# EAGLE design Motor shield 2.0 (EAGLE 6.3)
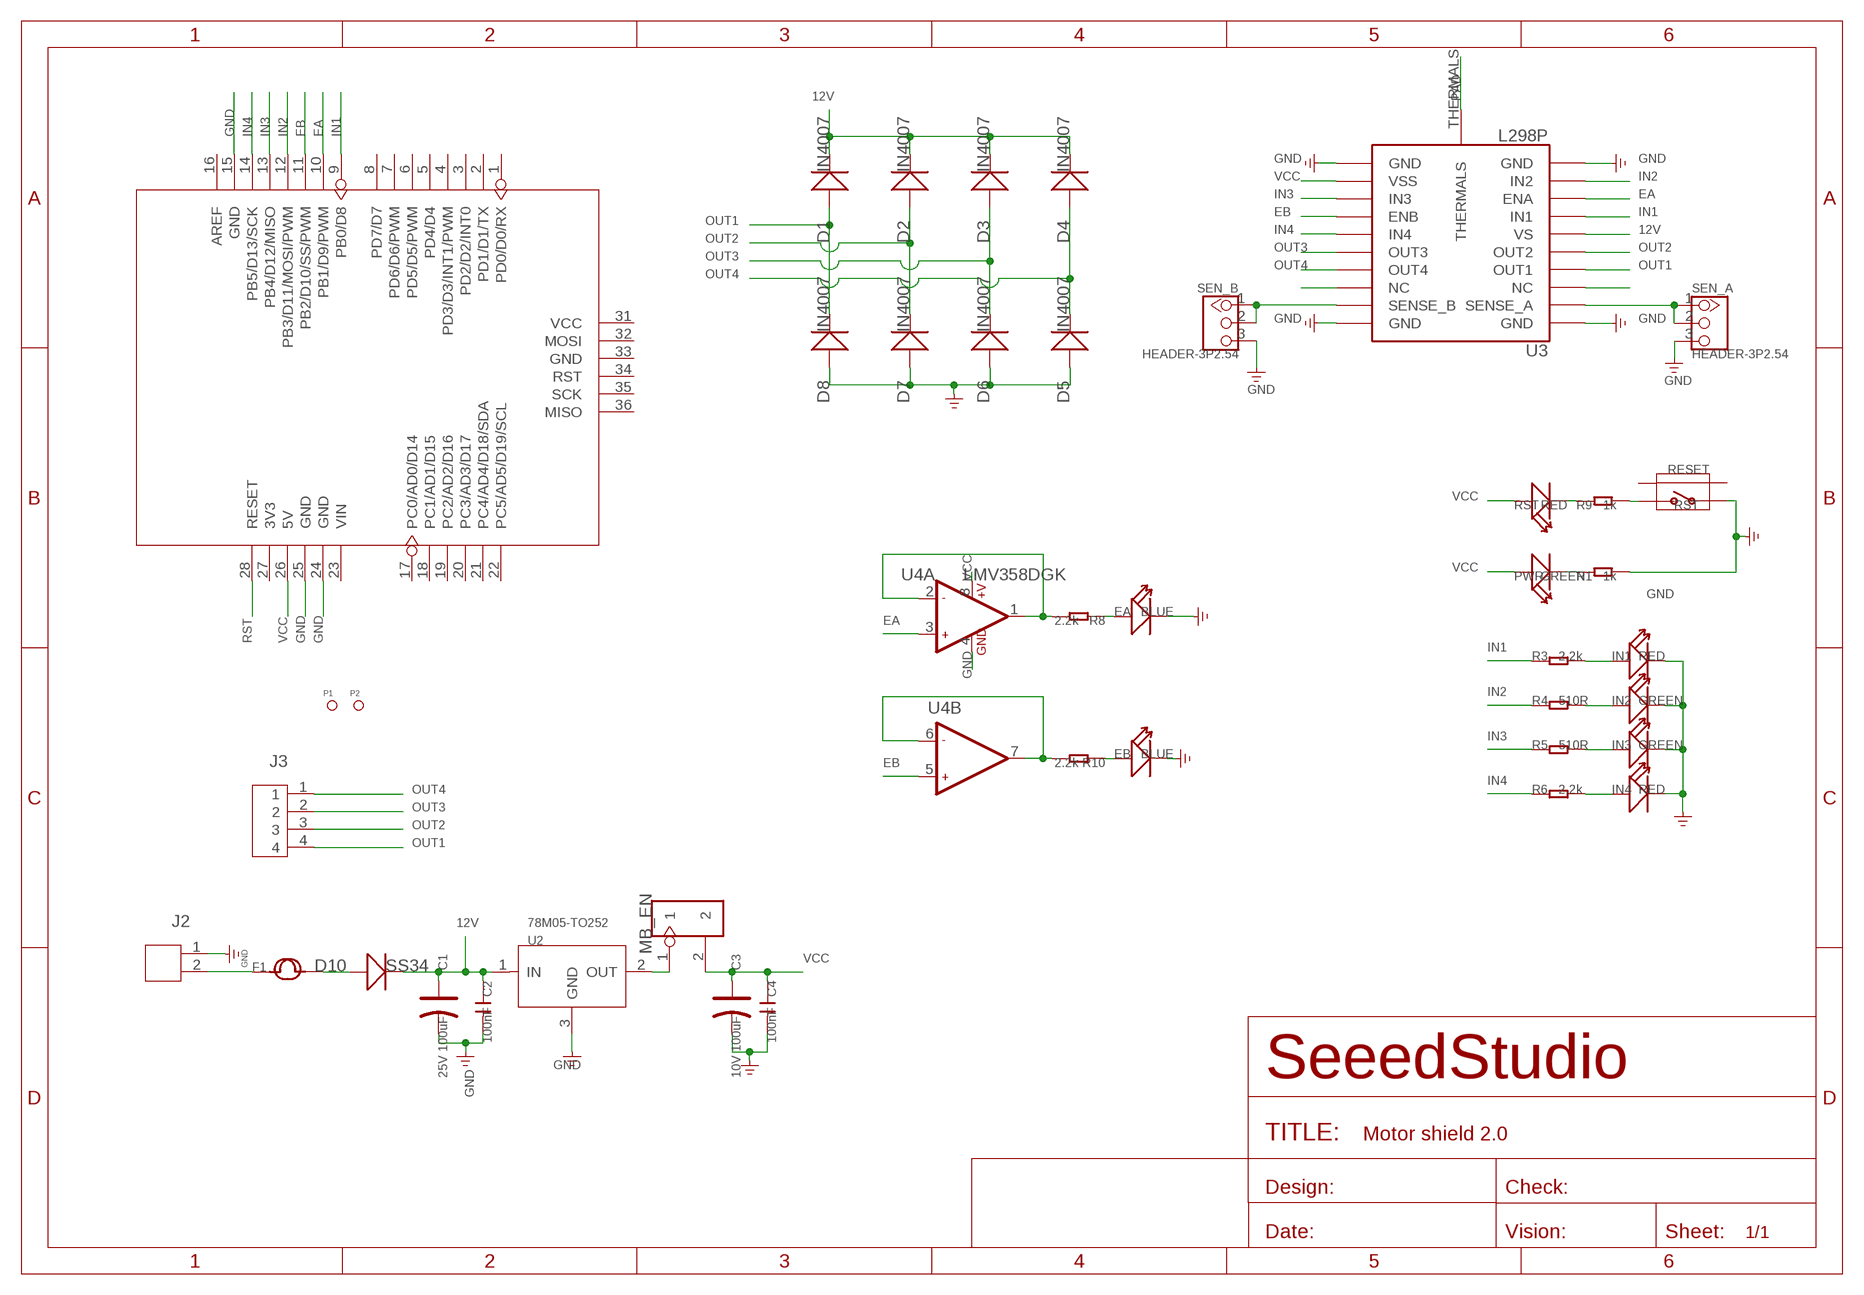
[diagram p0: schematic, sheet 1]

## Parts
C1  25V 100uF  CAP-ELECTRO-D  [ELECTRO-SMD-D-5.6MM]
C2  100nF  C-0603  [C0603]
C3  10V 100uF  CAP-AVX-B  [AVX-B]
C4  100nF  C-0603  [C0603]
D1  IN4007  D'SMA'  [D2010]
D2  IN4007  D'SMA'  [D2010]
D3  IN4007  D'SMA'  [D2010]
D4  IN4007  D'SMA'  [D2010]
D5  IN4007  D'SMA'  [D2010]
D6  IN4007  D'SMA'  [D2010]
D7  IN4007  D'SMA'  [D2010]
D8  IN4007  D'SMA'  [D2010]
D10  SS34  D'DO-214AB'  [DO-214AB]
EA  BLUE  007-LED0603  [D0603]
EB  BLUE  007-LED0603  [D0603]
F1  FUSE'RLD30P250UF'  [0311]
IN1  RED  007-LED0603  [D0603]
IN2  GREEN  007-LED0603  [D0603]
IN3  GREEN  007-LED0603  [D0603]
IN4  RED  007-LED0603  [D0603]
J2  JST-2P-LEADED'3.36'  [2P-3.36-LEADED-7X7]
J3  JST-4P-3.36-LEADED  [4P-3.36-LEADED-7X14]
MB_EN  HEADER-2P-65/35MIL  [2P-2.54-65/35MIL]
P1  PAD-MARK  [ROUND-MARK-1.0]
P2  PAD-MARK  [ROUND-MARK-1.0]
PWR  GREEN  007-LED0603  [D0603]
R1  1k  R-0603  [R0603]
R3  2.2k  R-0603  [R0603]
R4  510R  R-0603  [R0603]
R5  510R  R-0603  [R0603]
R6  2.2k  R-0603  [R0603]
R8  2.2k  R-0603  [R0603]
R9  1k  R-0603  [R0603]
R10  2.2k  R-0603  [R0603]
RESET  BUTTON-4P-REINFORCE'TS-118E'  [4P-SMD-7X3.5X3.5H]
RST  RED  007-LED0603  [D0603]
SEN_A  HEADER-3P2.54  [2.54_1X3P]
SEN_B  HEADER-3P2.54  [2.54_1X3P]
U1  ARDUINO'W/-SILK  [ARDUINO]
U2  78M05-TO252  [TO252]
U3  L298P  [POWERSO-20]
U4  LMV358DGK  [MSOP8]

## Nets
12V: C1.+ C2.1 D1.- D2.- D3.- D4.- D10.2(-) U2.1(IN) U3.P$6(VS)
EA: U1.10(PB1/D9/PWM) U3.P$8(ENA) U4.3(A:+IN1)
EB: U1.11(PB2/D10/SS/PWM) U3.P$14(ENB) U4.5(B:+IN2)
GND: C1.- C2.2 C3.- C4.2 D5.+ D6.+ D7.+ D8.+ EA.- EB.- IN1.- IN2.- IN3.- IN4.- J2.1 R1.2 RESET.1 SEN_A.3 SEN_B.3 U1.15(GND) U1.24(GND) U1.25(GND) U2.3(GND) U3.P$1(GND) U3.P$10(GND) U3.P$11(GND) U3.P$20(GND) U4.4(A:GND)
IN1: R3.1 U1.9(PB0/D8) U3.P$7(IN1)
IN2: R4.1 U1.12(PB3/D11/MOSI/PWM) U3.P$9(IN2)
IN3: R5.1 U1.13(PB4/D12/MISO) U3.P$13(IN3)
IN4: R6.1 U1.14(PB5/D13/SCK) U3.P$15(IN4)
N$1: IN3.+ R5.2
N$2: MB_EN.1 U2.2(OUT)
N$3: PWR.- R1.1
N$4: SEN_A.1 SEN_A.2 U3.P$2(SENSE_A)
N$6: F1.1 J2.2
N$7: U3.P$3(NC)
N$9: D10.1(+) F1.2
N$10: R9.1 RST.-
N$12: EA.+ R8.1
N$14: IN1.+ R3.2
N$15: IN2.+ R4.2
N$16: EB.+ R10.1
N$17: IN4.+ R6.2
N$18: R10.2 U4.6(B:-IN2) U4.7(B:OUT2)
N$19: R8.2 U4.1(A:OUT1) U4.2(A:-IN1)
N$20: SEN_B.1 SEN_B.2 U3.P$19(SENSE_B)
N$23: U3.P$18(NC)
OUT1: D1.+ D8.- J3.4 U3.P$4(OUT1)
OUT2: D2.+ D7.- J3.3 U3.P$5(OUT2)
OUT3: D3.+ D6.- J3.2 U3.P$16(OUT3)
OUT4: D4.+ D5.- J3.1 U3.P$17(OUT4)
PAD: U3.THERMALS
RST: R9.2 RESET.2 U1.28(RESET)
VCC: C3.+ C4.1 MB_EN.2 PWR.+ RST.+ U1.26(5V) U3.P$12(VSS) U4.8(A:+V)
Unconnected: RESET.S1 RESET.S2 U1.1(PD0/D0/RX) U1.2(PD1/D1/TX) U1.3(PD2/D2/INT0) U1.4(PD3/D3/INT1/PWM) U1.5(PD4/D4) U1.6(PD5/D5/PWM) U1.7(PD6/D6/PWM) U1.8(PD7/D7) U1.16(AREF) U1.17(PC0/AD0/D14) U1.18(PC1/AD1/D15) U1.19(PC2/AD2/D16) U1.20(PC3/AD3/D17) U1.21(PC4/AD4/D18/SDA) U1.22(PC5/AD5/D19/SCL) U1.23(VIN) U1.27(3V3) U1.31(VCC) U1.32(MOSI) U1.33(GND) U1.34(RST) U1.35(SCK) U1.36(MISO)

## Library data of the parts
C1 C3 = Discrete:CAP*: Electrolytic Capacitors,Tantalum Capacitors and Super Capacitors
C2 C4 = Discrete:C*: Ceramic Capacitors
D1-D8 D10 = Discrete:D*
EA EB IN1-IN4 PWR RST = Discrete:007-LED*
F1 = Discrete:FUSE
J2 = Connector:JST-2P-LEADED
J3 = Connector:JST-4P-3.36-LEADED
MB_EN = Connector:HEADER-2P
P1 P2 = Discrete:PAD-MARK; PARTNO: DNP
R1 R3-R6 R8-R10 = Discrete:R*
RESET = Discrete:BUTTON-4P-REINFORCE: TS-1188E http://www.best-dz.com/?thread-374-2.html
SEN_A SEN_B = Connector:HEADER-3P
U1 = moudle:ARDUINO
U2 = IC:78M05: 0.5A Three Terminal Positive Voltage Regulators
U3 = IC:L298: Dual Full-Bridge Driver http://www.sandorobotics.com/attachments/l298motores.pdf
U4 = IC:LMV358: General purpose LOW Voltage, Rail-to-Rail Output Amplifiers http://www.fairchildsemi.com/ds/LM/LMV358.pdf

## Board
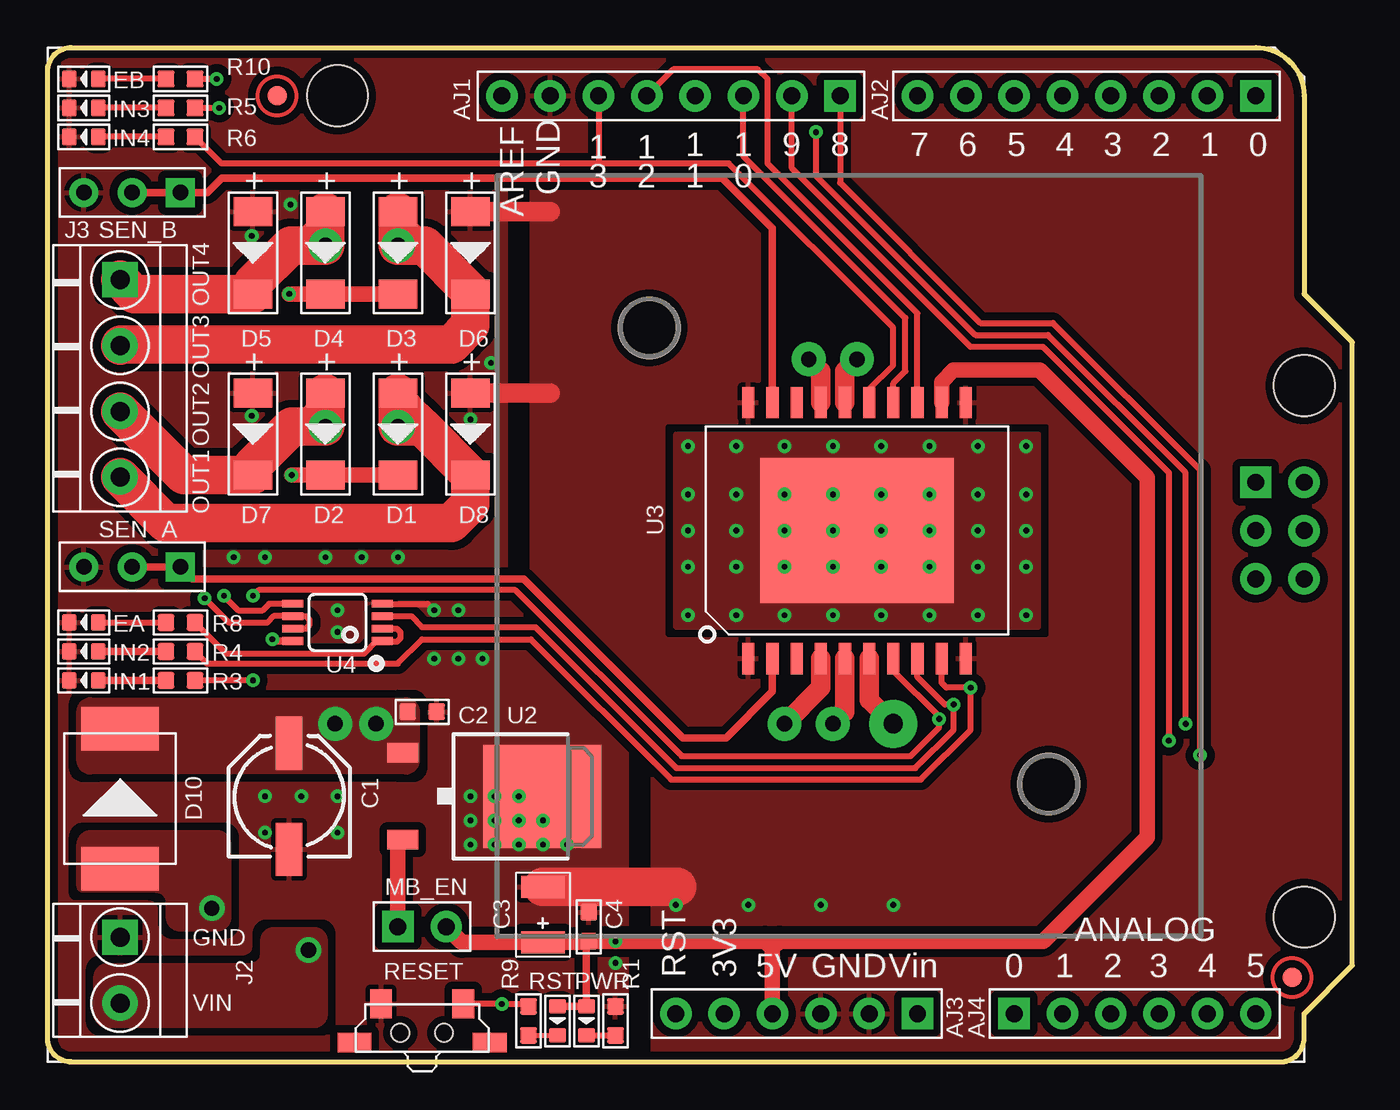
[diagram p1: board, top side]
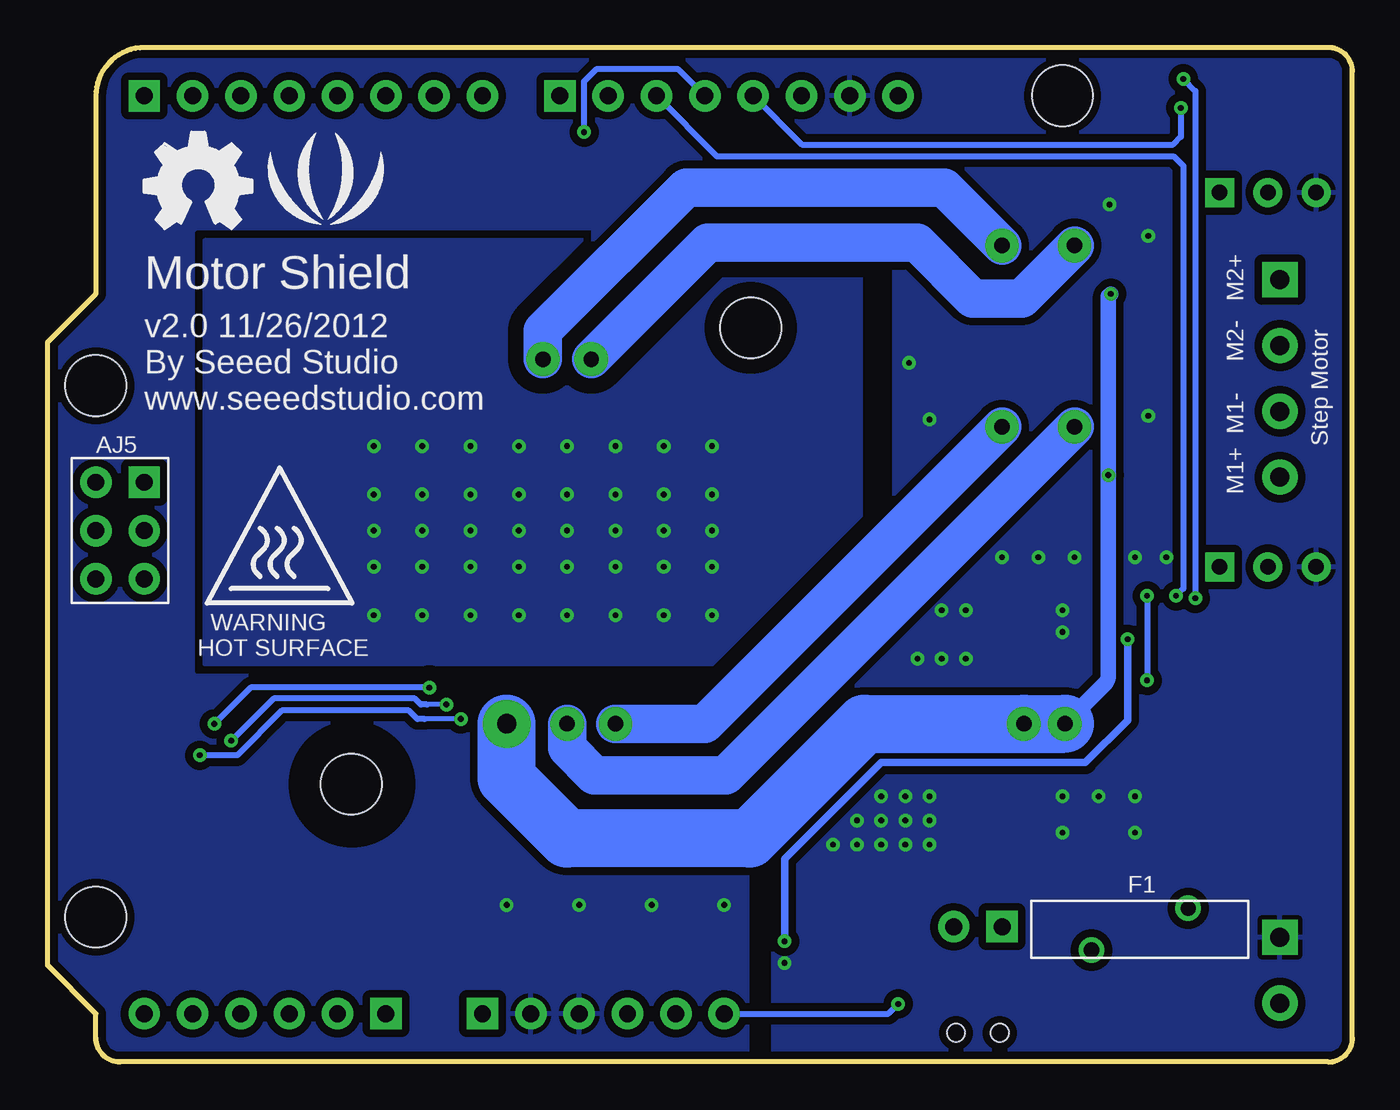
[diagram p2: board, bottom side, seen from below]

Size 68.58 x 53.34 mm. Coordinates in mm from the lower left corner, seen from the top.
Outline: 1.27,0 64.77,0 arc90 66.04,1.27 66.04,2.54 68.58,5.08 68.58,37.85 66.04,40.39 66.04,50.8 arc90 63.5,53.34 1.27,53.34 arc90 0,52.07 0,1.27 arc90 1.27,0
Copper layers (1*16): Top 0.035mm / dielectric 1.5mm / Bottom 0.035mm
Design rules "default *": minimum track width 8mil, minimum drill 12mil, track to track 8mil, track to pad 8mil, pad to pad 8mil, via to via 8mil, smd to smd 0mil, copper to edge 10mil, drill to drill 8mil, minimum pad ring 10mil, minimum via ring 8mil, stop-mask expansion 4mil, vias tented up to drill 100mil, thermal gap 10mil
Holes 3.2 mm at 31.62,38.6 52.62,14.6
tRestrict: 3 lines
bRestrict: area 49.7,11.7 to 55.5,17.5; 3 lines

### Footprints (pad centres in the part's own frame; a part is rotated, then mirrored left to right if it is on the bottom)
ELECTRO-SMD-D-5.6MM = smd 2.794 x 1.397: + 2.794,0; - -2.794,0
C0603 = smd 0.889 x 0.889: 1 -0.762,0; 2 0.762,0
AVX-B = smd 1.143 x 2.286: + -1.46,0; - 1.46,0
D2010 = smd 1.524 x 2.032: + -2.159,0; - 2.159,0
DO-214AB = smd 2.286 x 4.064: 1 -3.683,0; 2 3.683,0
D0603 = smd 0.762 x 0.889: + -0.762,0; - 0.762,0
0311 = drill 0.8 pad 1.35: 1 -2.54,-1.1; 2 2.54,1.1
2P-3.36-LEADED-7X7 = drill 1 pad 1.85 square: 1 -1.73,0 | drill 1 pad 1.85: 2 1.73,0
4P-3.36-LEADED-7X14 = drill 1 pad 1.85 square: 1 -5.19,0 | drill 1 pad 1.85: 2 -1.73,0; 3 1.73,0; 4 5.19,0
2P-2.54-65/35MIL = drill 0.889 pad 1.651 square: 1 0,1.27 | drill 0.889 pad 1.651: 2 0,-1.27
ROUND-MARK-1.0 = smd 1.016 x 1.016: P$1 0,0
R0603 = smd 0.889 x 0.889: 1 -0.762,0; 2 0.762,0
4P-SMD-7X3.5X3.5H = smd 1.143 x 1.524: 1 -2.159,1.524; 2 2.159,1.524 | smd 1.778 x 1.016: S1 -3.556,-0.508; S2 3.556,-0.508 | hole 0.95: -1.15,0; 1.15,0
2.54_1X3P = drill 0.813 pad 1.524 square: 1 0,2.54 | drill 0.813 pad 1.524: 2 0,0; 3 0,-2.54
ARDUINO = drill 0.889 pad 1.651 square: 1 63.5,50.8; 9 41.656,50.8; 17 50.8,2.54; 23 45.72,2.54; 36 63.5,30.48 | drill 0.889 pad 1.651: 2 60.96,50.8; 3 58.42,50.8; 4 55.88,50.8; 5 53.34,50.8; 6 50.8,50.8; 7 48.26,50.8; 8 45.72,50.8; 10 39.116,50.8; 11 36.576,50.8; 12 34.036,50.8; 13 31.496,50.8; 14 28.956,50.8; 15 26.416,50.8; 16 23.876,50.8; 18 53.34,2.54; 19 55.88,2.54; 20 58.42,2.54; 21 60.96,2.54; 22 63.5,2.54; 24 43.18,2.54; 25 40.64,2.54; 26 38.1,2.54; 27 35.56,2.54; 28 33.02,2.54; 31 66.04,30.48; 32 66.04,27.94; 33 66.04,25.4; 34 63.5,25.4; 35 63.5,27.94 | hole 3.2: 15.24,50.8; 66.04,35.56; 66.04,7.62
TO252 = smd 1.016 x 1.651: 1 -2.286,-4.826; 2 2.286,-4.826 | smd 5.4 x 6.2: 3 0,2.5
POWERSO-20 = smd 1.651 x 0.635: P$1 -6.731,5.715; P$2 -6.731,4.445; P$3 -6.731,3.175; P$4 -6.731,1.905; P$5 -6.731,0.635; P$6 -6.731,-0.635; P$7 -6.731,-1.905; P$8 -6.731,-3.175; P$9 -6.731,-4.445; P$10 -6.731,-5.715; P$11 6.731,-5.715; P$12 6.731,-4.445; P$13 6.731,-3.175; P$14 6.731,-1.905; P$15 6.731,-0.635; P$16 6.731,0.635; P$17 6.731,1.905; P$18 6.731,3.175; P$19 6.731,4.445; P$20 6.731,5.715 | smd 7.62 x 10.16: THERMALS 0,0
MSOP8 = smd 0.4 x 1.1: 1 -0.975,-2.35; 2 -0.325,-2.35; 3 0.325,-2.35; 4 0.975,-2.35; 5 0.975,2.35; 6 0.325,2.35; 7 -0.325,2.35; 8 -0.975,2.35

### Placement (x,y rotation side)
C1  12.7,13.97 90 top
C2  19.68,18.41 0 top
C3  26.04,7.75 90 top
C4  28.45,7.11 90 top
D1  18.41,33.02 270 top
D2  14.61,33.02 270 top
D3  18.41,42.55 270 top
D4  14.61,42.55 270 top
D5  10.79,42.55 270 top
D6  22.23,42.55 270 top
D7  10.79,33.02 270 top
D8  22.23,33.02 270 top
D10  3.81,13.84 90 top
EA  1.91,23.11 180 top
EB  1.91,51.69 180 top
F1  11.18,6.99 0 bottom
IN1  1.91,20.07 180 top
IN2  1.91,21.59 180 top
IN3  1.91,50.16 180 top
IN4  1.91,48.64 180 top
J2  3.81,4.83 270 top
J3  3.81,35.94 270 top
MB_EN  19.68,7.11 90 top
P1  12.06,50.8 0 top
P2  65.41,4.45 0 top
PWR  28.32,2.16 270 top
R1  29.84,2.16 90 top
R3  6.99,20.07 180 top
R4  6.99,21.59 180 top
R5  6.99,50.16 180 top
R6  6.99,48.64 180 top
R8  6.99,23.11 0 top
R9  25.27,2.16 90 top
R10  6.99,51.69 0 top
RESET  19.68,1.52 0 top
RST  26.8,2.16 270 top
SEN_A  4.45,26.04 270 top
SEN_B  4.45,45.72 270 top
U1  0,0 0 top
U2  23.5,13.97 270 top
U3  42.55,27.94 90 top
U4  15.24,23.11 90 top
U$15  [LOGO_SILK]  53.98,45.72 0 bottom
U$16  [OSHW_FILLX200_NOTEXT]  63.5,43.81 0 bottom

### Tracks (layer width: path | path; a pad name or v marks a point on that pad's centre or on a via)
12V  (via drill 0.3 pad 0.64, 0.81 pad 1.78, 1.02 pad 2.54)
  Top 0.813: v12.83,30.86 D2.- D1.- | v12.7,40.39 D4.- D3.-
  Top 1.016: U3.P$6 43.18,19.05 v44.45,17.78
  Bottom 0.813: v12.7,40.39 12.83,40.26 v12.83,30.86 12.83,20.33 arc45 13.01,19.88 v15.11,17.78
  Bottom 3.048: v44.45,17.78 44.45,14.92 41.29,11.76 31.68,11.76 25.65,17.78 v17.27,17.78 v15.11,17.78
  pour Top (isolate 0.254, no thermals): 2.29,19.05 18.8,19.05 arc-90 19.43,18.41 19.43,15.88 arc-90 18.8,15.24 2.29,15.24 arc-90 1.65,15.88 1.65,18.41 arc-90
EA  (via drill 0.3 pad 0.64)
  Top 0.305: U3.P$8 45.72,20.23 47.16,18.8 v47.62,18.8 47.62,17.47 45.62,15.46 33.05,15.46 25.65,22.86 19.68,22.86 19.11,23.44 U4.3 | v58.93,16.89 58.93,30.99 52.32,37.59 48.51,37.59 39.12,46.99 U1.10
  Bottom 0.254: v47.62,18.8 48.64,18.8
  Bottom 0.305: 48.64,18.8 48.96,18.8 49.28,19.11 56.71,19.11 v58.93,16.89
EB  (via drill 0.3 pad 0.64)
  Top 0.305: U3.P$14 44.45,35.69 45.09,36.32 45.09,39.12 36.58,47.62 U1.11 | v9.27,24.51 10.03,23.75 11.3,23.75 11.64,24.09 U4.5
  Bottom 0.305: U1.11 33.4,47.62 9.4,47.62 8.89,47.12 8.89,24.89 v9.27,24.51
GND  (via drill 0.3 pad 0.64)
  Top 0.305: U4.4 19.98,24.09 v20.32,23.75
  Top 1.016: D6.+ 26.42,44.7 | D8.+ 26.42,35.18
  Top 2.032: C3.- 33.08,9.21
  other vias: 22.23,13.97 22.23,11.43 24.77,11.43 24.77,13.97 27.3,11.43 24.77,12.7 22.23,12.7 14.61,26.54 18.41,26.54 11.43,26.54 11.43,13.97 13.34,13.97 15.24,13.97 15.24,12.06 11.43,12.06 33.02,8.26 29.84,5.21 36.83,8.26 40.64,8.26 44.45,8.26 22.23,33.78 23.3,36.77 12.76,45.09 10.73,43.43 10.73,33.97 16.51,26.54 9.78,26.54 23.5,13.97 23.5,12.7 23.5,11.43 26.04,11.43 26.04,12.7 21.59,23.75 20.32,21.21 21.59,21.21 22.86,21.21 15.24,23.75 15.24,22.61
  pour Top (no thermals): 21.34,17.14 29.21,17.14 29.21,10.79 21.34,10.79
  pour Top (isolate 0.254, rank 6): 0,60.33 3.17,60.33 3.17,57.15 0,57.15
  pour Top (isolate 0.406, rank 6): 0,53.34 68.58,53.34 68.58,0 0,0
  pour Bottom (isolate 0.406, rank 6): 0,53.34 68.58,53.34 68.58,0 0,0
IN1  (via drill 0.3 pad 0.64)
  Top 0.305: v10.79,24.51 11.1,24.82 24.59,24.82 33.32,16.08 45.36,16.08 46.86,17.59 v46.86,18.03 46.86,18.16 44.45,20.57 U3.P$7 | v10.79,20.07 R3.1 | U1.9 41.66,46.23 49.02,38.86 52.83,38.86 60.58,31.11 v60.58,16.13
  Bottom 0.254: v46.86,18.03 48.77,18.03
  Bottom 0.305: v10.79,24.51 v10.79,20.07 | 48.77,18.03 49.15,18.03 49.59,18.48 56.26,18.48 58.61,16.13 v60.58,16.13
IN2  (via drill 0.3 pad 0.64)
  Top 0.305: U3.P$9 46.99,19.94 47.24,19.68 v48.51,19.68 48.51,17.46 45.9,14.85 32.78,14.85 25.4,22.23 19.68,22.23 18.41,20.95 8.38,20.95 R4.1 | v40.39,48.9 40.39,46.61 48.77,38.23 52.58,38.23 59.82,30.99 v59.82,17.78
  Top 0.406: R4.1 7.87,21.59
  Bottom 0.305: v48.51,19.68 57.91,19.68 v59.82,17.78 | U1.12 35.43,52.2 39.75,52.2 40.39,51.56 v40.39,48.9
IN3  (via drill 0.3 pad 0.64)
  Top 0.305: U3.P$13 45.72,39.37 37.85,47.24 37.85,51.69 37.34,52.2 32.89,52.2 U1.13 | R5.1 v9.02,50.16
  Bottom 0.305: U1.13 28.93,48.24 9.42,48.24 9.02,48.64 v9.02,50.16
IN4
  Top 0.305: U3.P$15 43.18,35.37 44.44,36.63 44.44,38.62 35.81,47.24 29.08,47.24 | 29.08,47.24 28.83,47.24 | U1.14 28.96,47.37 | 28.96,47.37 28.83,47.24 | 28.96,47.37 29.08,47.24 | R6.1 9.14,47.24 28.83,47.24
N$1
  Top 0.305: R5.2 IN3.+
N$2
  Top 0.813: MB_EN.1 18.41,11.43 U2.2
N$3
  Top 0.305: PWR.- R1.1
N$4
  Top 0.406: SEN_A.2 SEN_A.1 7.62,25.4 25.02,25.4 33.37,17.05 35.67,17.05 38.1,19.48 U3.P$2
N$6
  pour Top (isolate 0.254, no thermals): 3.17,5.08 10.67,5.08 arc90 11.3,5.71 11.3,6.35 arc-90 11.94,6.99 13.97,6.99 arc-90 14.61,6.35 14.61,2.54 arc-90 13.97,1.91 3.17,1.91 arc-90 2.54,2.54 2.54,4.45 arc-90
N$9
  pour Top (isolate 0.254, no thermals): 5.71,9.02 1.91,9.02 arc-90 1.65,9.27 1.65,11.43 arc-90 2.29,12.06 8.89,12.06 arc-90 9.53,11.43 9.53,7.62 arc-90 8.89,6.99 6.99,6.99 arc-90 6.35,7.62 6.35,8.38 arc90
N$10
  Top 0.254: R9.1 RST.-
N$12
  Top 0.305: EA.+ R8.1
N$14
  Top 0.406: IN1.+ R3.2
N$15
  Top 0.406: IN2.+ R4.2
N$16
  Top 0.305: R10.1 EB.+
N$17
  Top 0.305: R6.2 IN4.+
N$18  (via drill 0.3 pad 0.64)
  Top 0.305: R10.2 v8.89,51.69 | U4.7 13.58,22.79 13.77,22.98 13.77,23.25 13.58,23.44 U4.6 11.88,23.44 11.53,23.09 9.55,23.09 v8.26,24.38
  Bottom 0.305: v8.89,51.69 8.26,51.05 v8.26,24.38
N$19
  Top 0.305: R8.2 9.4,21.46 16.64,21.46 17.31,22.14 U4.1 17.63,22.1 18.36,22.1 18.54,22.28 18.54,22.61 18.36,22.79 U4.2
N$20
  Top 0.406: SEN_B.2 SEN_B.1 8.38,45.72 9.14,46.48 35.46,46.48 38.1,43.84 U3.P$19
OUT1  (via drill 0.81 pad 1.78)
  Top 1.016: U3.P$4 40.64,19.68 v38.73,17.78
  Top 2.032: 19.68,33.4 v18.41,33.4 D1.+ | 19.68,33.4 D8.- 22.23,29.34 21.23,28.34 6.22,28.34 J3.4 | 19.68,33.4 18.8,34.29
  Bottom 2.032: v38.73,17.78 34.04,17.78 v18.41,33.4
OUT2  (via drill 0.81 pad 1.78)
  Top 1.016: U3.P$5 41.91,18.41 v41.27,17.78
  Top 2.032: 14.61,34.16 v14.61,33.4 12.83,33.4 10.79,31.37 D7.- 7.16,30.86 J3.3 | D2.+ 14.61,34.16 | 14.61,34.16 13.97,33.53
  Bottom 2.032: v14.61,33.4 32.93,15.08 39.84,15.08 41.27,16.51 v41.27,17.78
OUT3  (via drill 0.81 pad 1.78)
  Top 1.016: U3.P$16 41.91,36.32 v42.55,36.96
  Top 2.032: 19.18,42.93 v18.41,42.93 D3.+ 18.41,43.69 19.18,42.93 | 19.18,42.93 19.82,42.93 22.23,40.52 D6.- 22.23,38.73 21.21,37.72 3.86,37.72 J3.2
  Bottom 2.032: v42.55,36.96 42.55,38.45 35.02,45.97 21.46,45.97 v18.41,42.93
OUT4  (via drill 0.81 pad 1.78)
  Top 1.016: U3.P$17 40.64,36.32 v40.01,36.96
  Top 2.032: 14.61,43.69 v14.61,42.93 13.84,42.93 | 13.84,42.93 12.78,42.93 10.79,40.94 D5.- 4.55,40.39 J3.1 | D4.+ 14.61,43.69 | 14.61,43.69 13.84,42.93
  Bottom 2.032: v14.61,42.93 17.39,40.15 19.95,40.15 22.89,43.08 33.88,43.08 v40.01,36.96
PAD  (via drill 0.3 pad 0.64)
  other vias: 33.66,32.38 51.44,32.38 51.44,29.84 48.9,32.38 46.35,32.38 43.81,32.38 41.27,32.38 38.73,32.38 36.2,32.38 48.9,29.84 46.35,29.84 43.81,29.84 41.27,29.84 38.73,29.84 36.2,29.84 33.66,29.84 33.66,26.04 36.2,26.04 36.2,23.5 33.66,23.5 38.73,26.04 38.73,23.5 41.27,23.5 41.27,26.04 43.81,26.04 43.81,23.5 46.35,23.5 46.35,26.04 48.9,26.04 48.9,23.5 51.44,23.5 51.44,26.04 51.44,27.94 48.9,27.94 46.35,27.94 43.81,27.94 41.27,27.94 38.73,27.94 36.2,27.94 33.66,27.94
  pour Top (isolate 0.254, no thermals): 33.02,33.02 52.07,33.02 52.07,22.86 33.02,22.86
  pour Bottom (isolate 0.813, no thermals): 24.77,43.18 60.33,43.18 60.33,20.95 24.77,20.95
RST  (via drill 0.3 pad 0.64)
  Top 0.305: R9.2 25.15,3.05 v23.88,3.05 RESET.2
  Bottom 0.305: U1.28 24.38,2.54 v23.88,3.05
VCC  (via drill 0.3 pad 0.64)
  Top 0.406: RST.+ PWR.+ 28.32,6.22 C4.1 | U4.8 11.9,22.14 v11.81,22.23
  Top 0.813: MB_EN.2 21.78,6.29 C3.+ 28.38,6.29 C4.1 v29.84,6.35 37.72,6.35 | 37.72,6.35 38.48,6.35 | 38.48,6.35 52.32,6.35 57.78,11.81 57.78,30.73 52.15,36.37 47.6,36.37 46.99,35.76 U3.P$12 | 38.1,5.97 U1.26 | 38.1,5.97 38.48,6.35 | 38.1,5.97 37.72,6.35
  Bottom 0.406: v29.84,6.35 29.84,10.67 24.77,15.75 14.03,15.75 11.81,17.97 v11.81,22.23

### Text on the board
tPlace: AJ1 | AJ2 | + | + | + | + | AREF | OUT4 | OUT3 | + | + | + | + | OUT2 | OUT1 | GND | VIN | AJ3 | AJ4
bPlace: Motor Shield | M2+ | v2.0 11/26/2012 | M2- | By Seeed Studio | www.seeedstudio.com | M1- | Step Motor | AJ5 | M1+ | WARNING / HOT SURFACE